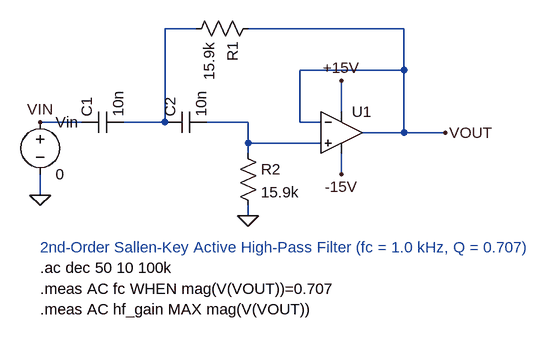
[diagram p0: schematic sallen_key_local.asc]
sallen_key_local.asc, the LTspice schematic file:
Version 4
SHEET 1 1100 700
WIRE 544 208 544 160
WIRE 544 272 544 304
WIRE 480 224 512 224
WIRE 480 224 480 144
WIRE 480 144 640 144
WIRE 80 224 144 224
WIRE 80 304 80 336
WIRE 208 224 272 224
WIRE 336 224 400 224
WIRE 400 224 400 256
WIRE 400 256 512 256
WIRE 400 256 400 272
WIRE 400 352 400 368
WIRE 272 224 272 80
WIRE 272 80 320 80
WIRE 400 80 640 80
WIRE 576 240 640 240
WIRE 640 80 640 240
WIRE 640 240 704 240
FLAG 544 160 +15V
FLAG 544 304 -15V
FLAG 80 224 VIN
FLAG 80 336 0
FLAG 400 368 0
FLAG 704 240 VOUT
SYMBOL OpAmps\UniversalOpAmp2 544 240 R0
SYMATTR InstName U1
SYMBOL voltage 80 208 R0
SYMATTR InstName Vin
SYMATTR Value 0
SYMATTR Value2 AC 1
SYMBOL cap 144 240 R270
SYMATTR InstName C1
SYMATTR Value 10n
SYMBOL cap 272 240 R270
SYMATTR InstName C2
SYMATTR Value 10n
SYMBOL res 384 256 R0
SYMATTR InstName R2
SYMATTR Value 15.9k
SYMBOL res 416 64 R90
SYMATTR InstName R1
SYMATTR Value 15.9k
TEXT 80 416 Left 2 ;2nd-Order Sallen-Key Active High-Pass Filter (fc = 1.0 kHz, Q = 0.707)
TEXT 80 448 Left 2 !.ac dec 50 10 100k
TEXT 80 480 Left 2 !.meas AC fc WHEN mag(V(VOUT))=0.707
TEXT 80 512 Left 2 !.meas AC hf_gain MAX mag(V(VOUT))

The netlist it stands for:
* sallen_key_local.asc
XU1 N002 VOUT +15V -15V VOUT level2 Avol=1Meg GBW=10Meg Slew=10Meg Ilimit=25m Rail=0 Vos=0 En=0 Enk=0 In=0 Ink=0 Rin=500Meg  ; pins In+ In- V+ V- OUT
Vin VIN 0 0 AC 1
C1 VIN N001 10n
C2 N001 N002 10n
R2 N002 0 15.9k
R1 VOUT N001 15.9k
* 2nd-Order Sallen-Key Active High-Pass Filter (fc = 1.0 kHz, Q = 0.707)
.ac dec 50 10 100k
.meas AC fc WHEN mag(V(VOUT))=0.707
.meas AC hf_gain MAX mag(V(VOUT))
.lib UniversalOpAmp2.lib
.backanno
.end